# Altium schematic sheet [06].HMS.Connector.SchDoc
size A4; SheetNumber: 7; SheetTotal: 7
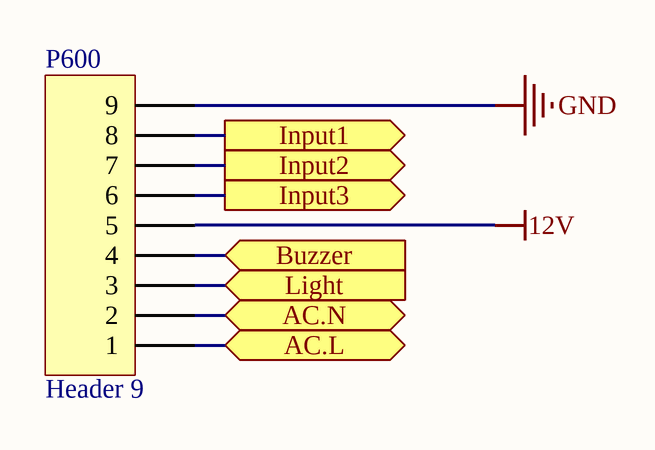
[diagram p0: [06].HMS.Connector.SchDoc]

## Parts
P600  Header 9  [KF2EDG3.5MM_9P]

## Ports
AC.L (bidir), AC.N (bidir), Buzzer (in), Input1 (out), Input2 (out), Input3 (out), Light (in)

## Nets
12V: P600.5
GND: P600.9
AC.L: P600.1 ; port AC.L
AC.N: P600.2 ; port AC.N
Buzzer: P600.4 ; port Buzzer
Input1: P600.8 ; port Input1
Input2: P600.7 ; port Input2
Input3: P600.6 ; port Input3
Light: P600.3 ; port Light

## Library data of the parts
P600 = Header 9: Header, 9-Pin; MPN: 15EDGRC-3.5-9P; LatestRevisionDate: 17-Jul-2002; LatestRevisionNote: Re-released for DXP Platform.; Publisher: Altium Limited